# Altium schematic sheet I2C_Interface.SchDoc
size Letter; Organization: Midnight Sun Solar Rayce Car Team; Address1: University of Waterloo; Address2: 200 University Ave W; Address3: Waterloo, ON, Canada; Address4: N2L 3E9; Website: www.uwmidsun.com
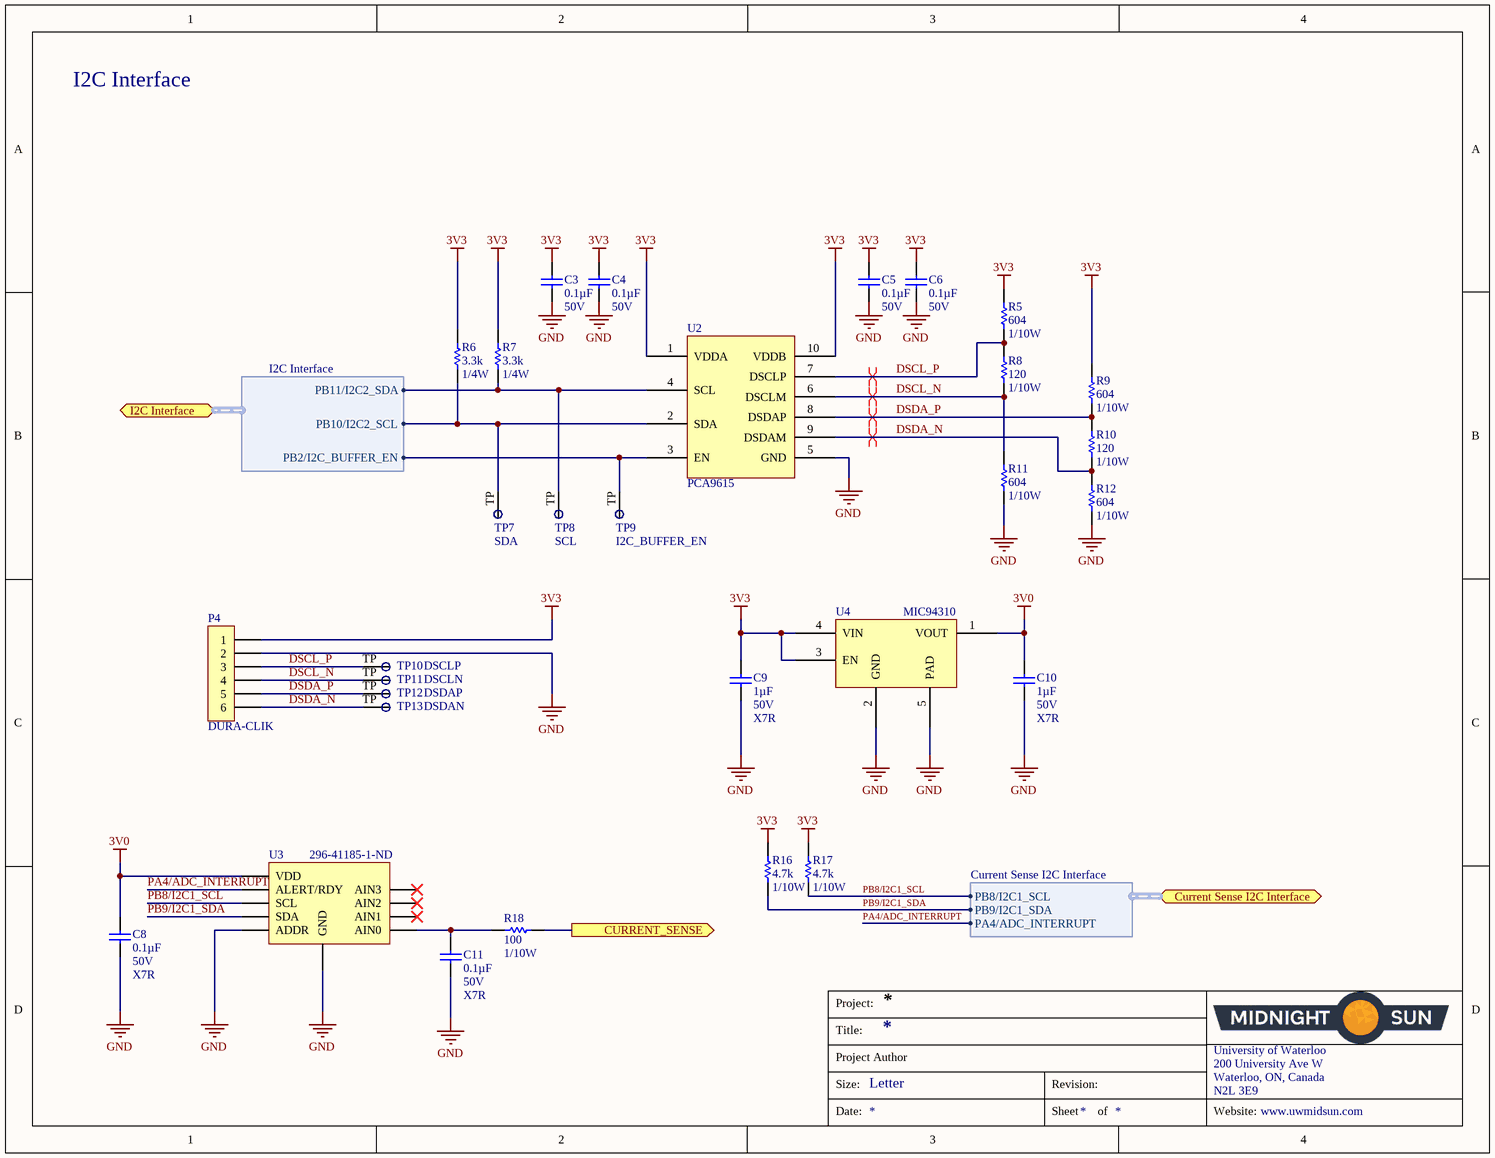
[diagram p0: I2C_Interface.SchDoc]

## Parts
C3  Capacitance: 0.1µF  Voltage: 50V  [CAP, 0603]  (hidden comment: CAP CER 0.1UF 50V 10% X7R 0603)
C4  Capacitance: 0.1µF  Voltage: 50V  [CAP, 0603]  (hidden comment: CAP CER 0.1UF 50V 10% X7R 0603)
C5  Capacitance: 0.1µF  Voltage: 50V  [CAP, 0603]  (hidden comment: CAP CER 0.1UF 50V 10% X7R 0603)
C6  Capacitance: 0.1µF  Voltage: 50V  [CAP, 0603]  (hidden comment: CAP CER 0.1UF 50V 10% X7R 0603)
C8  Capacitance: 0.1µF  Voltage: 50V  Temperature Coefficient: X7R  [CAP, 0603]  (hidden comment: CAP CER 0.1UF 50V 10% X7R 0603)
C9  Capacitance: 1µF  Voltage: 50V  Temperature Coefficient: X7R  [CAP, 0603]  (hidden comment: CAP CER 1UF 50V 10% X7R 0603)
C10  Capacitance: 1µF  Voltage: 50V  Temperature Coefficient: X7R  [CAP, 0603]  (hidden comment: CAP CER 1UF 50V 10% X7R 0603)
C11  Capacitance: 0.1µF  Voltage: 50V  Temperature Coefficient: X7R  [CAP, 0603]  (hidden comment: CAP CER 0.1UF 50V 10% X7R 0603)
P4  DURA-CLIK  [CONN, 6POS DURA-CLIK VERT]
R5  Resistance: 604  Power: 1/10W  [RES, 0603]  (hidden comment: RES 604 OHM 1% 1/10W 0603)
R6  Resistance: 3.3k  Power: 1/4W  [RES, 0603]  (hidden comment: RES 3.3K OHM 1% 1/4W 0603)
R7  Resistance: 3.3k  Power: 1/4W  [RES, 0603]  (hidden comment: RES 3.3K OHM 1% 1/4W 0603)
R8  Resistance: 120  Power: 1/10W  [RES, 0603]  (hidden comment: RES 120 OHM 1% 1/10W 0603)
R9  Resistance: 604  Power: 1/10W  [RES, 0603]  (hidden comment: RES 604 OHM 1% 1/10W 0603)
R10  Resistance: 120  Power: 1/10W  [RES, 0603]  (hidden comment: RES 120 OHM 1% 1/10W 0603)
R11  Resistance: 604  Power: 1/10W  [RES, 0603]  (hidden comment: RES 604 OHM 1% 1/10W 0603)
R12  Resistance: 604  Power: 1/10W  [RES, 0603]  (hidden comment: RES 604 OHM 1% 1/10W 0603)
R16  Resistance (Ohms): 4.7k  Power (Watts): 1/10W  [RES, 0603]  (hidden comment: RES 4.7K OHM 1% 1/10W 0603)
R17  Resistance (Ohms): 4.7k  Power (Watts): 1/10W  [RES, 0603]  (hidden comment: RES 4.7K OHM 1% 1/10W 0603)
R18  Resistance: 100  Power: 1/10W  [RES, 0603]  (hidden comment: RES 100 OHM 1% 1/10W 0603)
TP7  SDA  [Test Point]  (no BOM)
TP8  SCL  [Test Point]  (no BOM)
TP9  I2C_BUFFER_EN  [Test Point]  (no BOM)
TP10  DSCLP  [Test Point]  (no BOM)
TP11  DSCLN  [Test Point]  (no BOM)
TP12  DSDAP  [Test Point]  (no BOM)
TP13  DSDAN  [Test Point]  (no BOM)
U2  Base Part Number: PCA9615  [TSSOP50P490X110-10N]  (hidden comment: IC DIFFERENTIAL I2C BUFFER PCA9615)
U3  Supplier Part Number 1: 296-41185-1-ND  [IC ADC VSSOP10]  (hidden comment: Quad ADC)
U4  MIC94310  [IC REG LDO 3V 0.2A 4-TDFN]

## Ports
Current Sense I2C Interface (harness Current Sense I2C Interface), CURRENT_SENSE (out), I2C Interface (harness I2C Interface)

## Harnesses
I2C Interface: PB10/I2C2_SCL, PB11/I2C2_SDA, PB2/I2C_BUFFER_EN
Current Sense I2C Interface: PB8/I2C1_SCL, PB9/I2C1_SDA, PA4/ADC_INTERRUPT

## Nets
3V0: C8.1 C10.1 U3.8(VDD) U4.1(VOUT)
3V3: C3.1 C4.1 C5.1 C6.1 C9.1 P4.1 R5.1 R6.1 R7.1 R9.1 R16.1 R17.1 U2.1(VDDA) U2.10(VDDB) U4.3(EN) U4.4(VIN)
GND: C3.2 C4.2 C5.2 C6.2 C8.2 C9.2 C10.2 C11.2 P4.2 R11.2 R12.2 U2.5(GND) U3.1(ADDR) U3.3(GND) U4.2(GND) U4.5(PAD)
CURRENT_SENSE: R18.1 ; port CURRENT_SENSE
DSCL_N: P4.4 R8.2 R11.1 TP11.TP U2.6(DSCLM)
DSCL_P: P4.3 R5.2 R8.1 TP10.TP U2.7(DSCLP)
DSDA_N: P4.6 R10.2 R12.1 TP13.TP U2.9(DSDAM)
DSDA_P: P4.5 R9.2 R10.1 TP12.TP U2.8(DSDAP)
PA4/ADC_INTERRUPT: U3.2(ALERT/RDY) ; port Current Sense I2C Interface.PA4/ADC_INTERRUPT
PB8/I2C1_SCL: R17.2 U3.10(SCL) ; port Current Sense I2C Interface.PB8/I2C1_SCL
PB9/I2C1_SDA: R16.2 U3.9(SDA) ; port Current Sense I2C Interface.PB9/I2C1_SDA
NetC11_1: C11.1 R18.2 U3.4(AIN0)
NetR6_2: R6.2 TP7.TP U2.2(SDA) ; port I2C Interface.PB10/I2C2_SCL
NetR7_2: R7.2 TP8.TP U2.4(SCL) ; port I2C Interface.PB11/I2C2_SDA
NetTP9_TP: TP9.TP U2.3(EN) ; port I2C Interface.PB2/I2C_BUFFER_EN

Not connected (* = marked no-connect by the designer): U3 5(AIN1)* 6(AIN2)* 7(AIN3)*

## Layout directives
differential pair: DSCL_N, DSCL_P, DSDA_N, DSDA_P

## Notes on the sheet
- I2C Interface
- Project:
- Title:
- Size:
- Project Author
- Letter
- Revision:
- University of Waterloo
- 200 University Ave W
- Waterloo, ON, Canada
- N2L 3E9
- Date:
- Sheet
- of
- Website:

## Library data of the parts
C3-C6 C8 C11 = CAP CER 0.1UF 50V 10% X7R 0603: 0.10µF ±10% 50V Ceramic Capacitor X7R 0603 (1608 Metric); Manufacturer 1: AVX Corporation; Manufacturer Part Number 1: 06035C104KAT2A; Supplier 1: Digi-Key; Supplier Part Number 1: 478-5052-1-ND; Packaging: Cut Tape (CT); Part Status: Active; Operating Temperature: -55°C ~ 125°C; Ratings: -; Mounting Type: Surface Mount, MLCC; Package / Case: 0603 (1608 Metric); Size / Dimension: 0.063" L x 0.032" W (1.60mm x 0.81mm); Height - Seated (Max): -; Thickness (Max): 0.035" (0.90mm); Lead Spacing: -; Lead Style: -; ComponentLink1URL: http://datasheets.avx.com/X7RDielectric.pdf; ComponentLink1Description: http://datasheets.avx.com/X7RDielectric.pdf; Tolerance: ±10%
  C3-C6: Temperature Coefficient: X7R
C9 C10 = CAP CER 1UF 50V 10% X7R 0603: 1µF ±10% 50V Ceramic Capacitor X7R 0603 (1608 Metric); Manufacturer 1: Taiyo Yuden; Manufacturer Part Number 1: UMK107AB7105KA-T; Supplier 1: Digi-Key; Supplier Part Number 1: 587-3247-1-ND; Packaging: Cut Tape (CT); Part Status: Active; Operating Temperature: -55°C ~ 125°C; Ratings: -; Mounting Type: Surface Mount, MLCC; Package / Case: 0603 (1608 Metric); Size / Dimension: 0.063" L x 0.031" W (1.60mm x 0.80mm); Height - Seated (Max): -; Thickness (Max): 0.037" (0.95mm); Lead Spacing: -; Lead Style: -; ComponentLink1URL: http://www.yuden.co.jp/productdata/catalog/en/mlcc_all_e.pdf; ComponentLink1Description: http://www.yuden.co.jp/productdata/catalog/en/mlcc_all_e.pdf; Tolerance: ±10%
P4 = CONN 6POS DURA-CLIK 0.079": 6 Positions Header, Shrouded Connector 0.079" (2.00mm) Surface Mount, Vertical Tin; Manufacturer: Molex; Manufacturer Part Number: 5600200820; Style: Board to Cable/Wire; Shrouding: Shrouded - 4 Wall; Number of Positions: 6; Number of Positions Loaded: All; Mated Stacking Heights: 9.3mm; Supplier 1: Digi-Key; Supplier Part Number 1: WM10866CT-ND; RoHS: RoHS Compliant; Category: Connectors, Interconnects; Stock 1: 3826; Pricing 1: 1=1.76, 10=1.542, 25=1.4512, 50=1.391, 100=1.3305, 250=1.20956 (CAD); Packaging: Cut Tape (CT); Part Status: Active; Connector Type: Header; Contact Type: Male Pin; Pitch - Mating: 0.079" (2.00mm); Number of Rows: 1; Row Spacing - Mating: -; Mounting Type: Surface Mount; Termination: Solder; Fastening Type: Latch Lock; Contact Length - Mating: -; Contact Length - Post: -; Overall Contact Length: -; Insulation Height: 0.315" (8.00mm); Contact Shape: Square; Contact Finish - Mating: Tin; Contact Finish Thickness - Mating: -; Contact Finish - Post: Tin; Contact Material: Copper Alloy; Insulation Material: Polyamide (PA), Nylon; Features: Solder Retention; Operating Temperature: -; Ingress Protection: -; Material Flammability Rating: -; Insulation Color: Natural; Current Rating: -; Voltage Rating: -; Contact Finish Thickness - Post: -; Applications: Automotive, Industrial; ComponentLink1URL: http://www.molex.com/pdm_docs/sd/5600200220_sd.pdf; ComponentLink1Description: http://www.molex.com/pdm_docs/sd/5600200220_sd.pdf
R5 R9 R11 R12 = RES 604 OHM 1% 1/10W 0603: RES SMD 604 OHM 1% 1/10W 0603; Manufacturer 1: Yageo; Manufacturer Part Number 1: RC0603FR-07604RL; Temperature Coefficient: ±100ppm/°C; Supplier 1: Digi-Key; Supplier Part Number 1: 311-604HRCT-ND; Packaging: Cut Tape (CT); Part Status: Active; Composition: Thick Film; Operating Temperature: -55°C ~ 155°C; Package / Case: 0603 (1608 Metric); Supplier Device Package: 0603; Size / Dimension: 0.063" L x 0.031" W (1.60mm x 0.80mm); Height - Seated (Max): 0.022" (0.55mm); Failure Rate: -; ComponentLink1URL: http://www.yageo.com/documents/recent/PYu-RC_Group_51_RoHS_L_7.pdf; ComponentLink1Description: http://www.yageo.com/documents/recent/PYu-RC_Group_51_RoHS_L_7.pdf; Tolerance: ±1%
R6 R7 = RES 3.3K OHM 1% 1/4W 0603: 3.3k Ohm ±1% 0.25W, 1/4W Chip Resistor 0603 (1608 Metric) Automotive AEC-Q200, Pulse Withstanding Thick Film; Manufacturer 1: Panasonic Electronic Components; Manufacturer Part Number 1: ERJ-PA3F3301V; Temperature Coefficient: ±100ppm/°C; Supplier 1: Digi-Key; Supplier Part Number 1: P3.3KBYCT-ND; Packaging: Cut Tape (CT); Part Status: Active; Composition: Thick Film; Operating Temperature: -55°C ~ 155°C; Package / Case: 0603 (1608 Metric); Supplier Device Package: 0603; Size / Dimension: 0.063" L x 0.031" W (1.60mm x 0.80mm); Height - Seated (Max): 0.022" (0.55mm); Failure Rate: -; ComponentLink1URL: https://industrial.panasonic.com/cdbs/www-data/pdf/RDO0000/AOA0000C291.pdf; ComponentLink1Description: https://industrial.panasonic.com/cdbs/www-data/pdf/RDO0000/AOA0000C291.pdf; Tolerance: ±1%
R8 R10 = RES 120 OHM 1% 1/10W 0603: RES SMD 120 OHM 1% 1/10W 0603; Manufacturer 1: Yageo; Manufacturer Part Number 1: RC0603FR-07120RL; Temperature Coefficient: ±100ppm/°C; Supplier 1: Digi-Key; Supplier Part Number 1: 311-120HRCT-ND; Packaging: Cut Tape (CT); Part Status: Active; Composition: Thick Film; Operating Temperature: -55°C ~ 155°C; Package / Case: 0603 (1608 Metric); Supplier Device Package: 0603; Size / Dimension: 0.063" L x 0.031" W (1.60mm x 0.80mm); Height - Seated (Max): 0.022" (0.55mm); Failure Rate: -; ComponentLink1URL: http://www.yageo.com/documents/recent/PYu-RC_Group_51_RoHS_L_7.pdf; ComponentLink1Description: http://www.yageo.com/documents/recent/PYu-RC_Group_51_RoHS_L_7.pdf; Tolerance: ±1%
R16 R17 = RES 4.7K OHM 1% 1/10W 0603: 4.7k Ohm ±1% 0.1W, 1/10W Chip Resistor 0603 (1608 Metric) Moisture Resistant Thick Film; Manufacturer 1: Yageo; Manufacturer Part Number 1: RC0603FR-074K7L; Description 1: RES SMD 4.7K OHM 1% 1/10W 0603; Temperature Coefficient: ±100ppm/°C; Supplier 1: Digi-Key; Supplier Part Number 1: 311-4.70KHRCT-ND; RoHS: RoHS Compliant; Category: Resistors; Stock 1: 3487566; Pricing 1: 1=0.16, 10=0.022, 100=0.0089, 1000=0.00402, 2500=0.00349 (CAD); Packaging: Cut Tape (CT); Part Status: Active; Composition: Thick Film; Features: Moisture Resistant; Operating Temperature: -55°C ~ 155°C; Package / Case: 0603 (1608 Metric); Supplier Device Package: 0603; Size / Dimension: 0.063" L x 0.031" W (1.60mm x 0.80mm); Height - Seated (Max): 0.022" (0.55mm); Failure Rate: -; ComponentLink1URL: http://www.yageo.com/documents/recent/PYu-RC_Group_51_RoHS_L_7.pdf; ComponentLink1Description: http://www.yageo.com/documents/recent/PYu-RC_Group_51_RoHS_L_7.pdf; Tolerance: ±1%
R18 = RES 100 OHM 1% 1/10W 0603: 100 Ohm ±1% 0.1W, 1/10W Chip Resistor 0603 (1608 Metric) Moisture Resistant Thick Film; Manufacturer 1: Yageo; Manufacturer Part Number 1: RC0603FR-07100RL; Temperature Coefficient: ±100ppm/°C; Supplier 1: Digi-Key; Supplier Part Number 1: 311-100HRCT-ND; Packaging: Cut Tape (CT); Part Status: Active; Composition: Thick Film; Operating Temperature: -55°C ~ 155°C; Package / Case: 0603 (1608 Metric); Supplier Device Package: 0603; Size / Dimension: 0.063" L x 0.031" W (1.60mm x 0.80mm); Height - Seated (Max): 0.022" (0.55mm); Failure Rate: -; ComponentLink1URL: http://www.yageo.com/documents/recent/PYu-RC_Group_51_RoHS_L_7.pdf; ComponentLink1Description: http://www.yageo.com/documents/recent/PYu-RC_Group_51_RoHS_L_7.pdf; Tolerance: ±1%
TP7-TP13 = Test Point
U2 = IC DIFFERENTIAL I2C BUFFER PCA9615: Buffer, ReDriver 2 Channel 400kHz 10-TSSOP; Manufacturer: NXP USA Inc.; Manufacturer Part Number: PCA9615DPJ; Input: 2-Wire Bus; Number of Channels: 2; Voltage - Supply: 2.3 V ~ 5.5 V; Current - Supply: 16µA; Supplier 1: Digi-Key; RoHS: RoHS Compliant; Category: Integrated Circuits (ICs); Stock 1: 7673; Pricing 1: 1=4.38, 10=3.93, 100=3.2205, 500=2.74156, 1000=2.31216 (CAD); Packaging: Cut Tape (CT); Part Status: Active; Type: Buffer, ReDriver; Applications: I²C; Output: 2-Wire Bus; Data Rate (Max): 400kHz; Delay Time: -; Signal Conditioning: -; Operating Temperature: -40°C ~ 85°C; Package / Case: 10-TFSOP, 10-MSOP (0.118", 3.00mm Width); Supplier Device Package: 10-TSSOP; ComponentLink1URL: http://www.nxp.com/documents/data_sheet/PCA9615.pdf; ComponentLink1Description: http://www.nxp.com/documents/data_sheet/PCA9615.pdf; Supplier Part Number 1: 568-11484-1-ND
U3 = IC ADC 12-BIT VSSOP-10: 12 Bit Analog to Digital Converter 4 Input 1 Sigma-Delta 10-VSSOP; Manufacturer: Texas Instruments; Manufacturer Part Number: ADS1015IDGSR; Number of Bits: 12; Sampling Rate (Per Second): 3.3k; Number of Inputs: 2, 4; Input Type: Differential, Single Ended; Data Interface: I²C; Configuration: MUX-PGA-ADC; Number of A/D Converters: 1; Reference Type: Internal; Voltage - Supply, Analog: 2 V ~ 5.5 V; Supplier 1: Digi-Key; RoHS: RoHS Compliant; Category: Integrated Circuits (ICs); Stock 1: 4084; Pricing 1: 1=4.25, 10=3.807, 100=3.1194, 500=2.65552, 1000=2.23959 (CAD); Packaging: Cut Tape (CT); Part Status: Active; Ratio - S/H:ADC: -; Architecture: Sigma-Delta; Voltage - Supply, Digital: 2 V ~ 5.5 V; Features: PGA, Selectable Address; Operating Temperature: -40°C ~ 125°C; Package / Case: 10-TFSOP, 10-MSOP (0.118", 3.00mm Width); Supplier Device Package: 10-VSSOP; ComponentLink1URL: http://www.ti.com/lit/ds/symlink/ads1013.pdf; ComponentLink1Description: http://www.ti.com/lit/ds/symlink/ads1013.pdf
U4 = IC REG LDO 3V 0.2A 4-TDFN: Manufacturer: Microchip Technology; Manufacturer Part Number: MIC94310-PYMT-TR; Regulator Topology: Positive Fixed; Voltage - Output: 3V; Current - Output: 200mA; Voltage - Dropout (Typical): 0.04V @ 200mA; Voltage - Input: Up to 3.6V; Current - Limit (Min): 250mA; Supplier 1: Digi-Key; RoHS: RoHS Compliant; Category: Integrated Circuits (ICs); Stock 1: 4802; Pricing 1: 1=0.45, 25=0.3708, 100=0.3386 (CAD); Packaging: Cut Tape (CT); Part Status: Active; Operating Temperature: -40°C ~ 125°C; Mounting Type: Surface Mount; Package / Case: 4-UFDFN Exposed Pad; Supplier Device Package: 4-TDFN (1.2x1.6); ComponentLink1URL: http://www.microchip.com/mymicrochip/filehandler.aspx?ddocname=en580409; ComponentLink1Description: http://www.microchip.com/mymicrochip/filehandler.aspx?ddocname=en580409; Supplier Part Number 1: 576-4761-1-ND